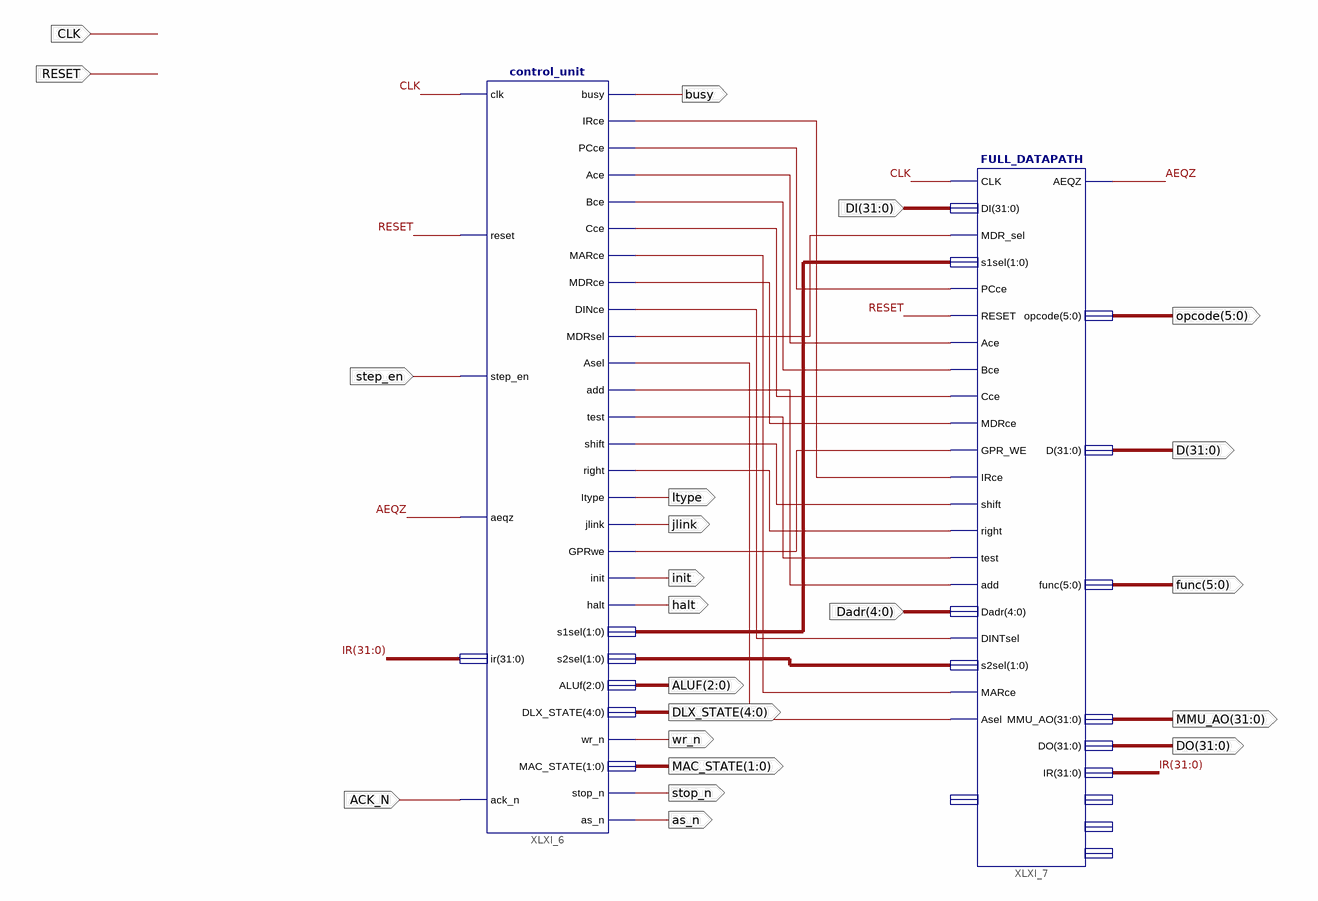
[diagram p0: schematic sheet 1]
// Xilinx ISE schematic DLX.sch (spartan6) as structural Verilog: 2 symbols, 22 ports
module DLX (
  input  CLK,
  input  RESET,
  input  [31:0] DI,
  input  [4:0] Dadr,
  input  step_en,
  input  ACK_N,
  output [5:0] func,
  output [31:0] MMU_AO,
  output [31:0] D,
  output [5:0] opcode,
  output busy,
  output Itype,
  output jlink,
  output init,
  output halt,
  output [2:0] ALUF,
  output [4:0] DLX_STATE,
  output wr_n,
  output [1:0] MAC_STATE,
  output stop_n,
  output as_n,
  output [31:0] DO
);

  wire AEQZ, XLXN_15, XLXN_16, XLXN_17, XLXN_18, XLXN_19, XLXN_20, XLXN_21, XLXN_22, XLXN_27, XLXN_28,
       XLXN_29, XLXN_30, XLXN_31, XLXN_32, XLXN_38;
  wire [1:0] XLXN_39, XLXN_40;
  wire [31:0] IR;

  control_unit XLXI_6 (
    .clk(CLK), .reset(RESET), .step_en(step_en), .aeqz(AEQZ), .ir(IR), .ack_n(ACK_N), .busy(busy),
    .IRce(XLXN_32), .PCce(XLXN_22), .Ace(XLXN_19), .Bce(XLXN_20), .Cce(XLXN_21), .MARce(XLXN_29),
    .MDRce(XLXN_27), .DINce(XLXN_30), .MDRsel(XLXN_28), .Asel(XLXN_31), .add(XLXN_15), .test(XLXN_16),
    .shift(XLXN_17), .right(XLXN_18), .Itype(Itype), .jlink(jlink), .GPRwe(XLXN_38), .init(init),
    .halt(halt), .s1sel(XLXN_39), .s2sel(XLXN_40), .ALUf(ALUF), .DLX_STATE(DLX_STATE), .wr_n(wr_n),
    .MAC_STATE(MAC_STATE), .stop_n(stop_n), .as_n(as_n));
  FULL_DATAPATH XLXI_7 (
    .CLK(CLK), .DI(DI), .MDR_sel(XLXN_28), .s1sel(XLXN_39), .PCce(XLXN_22), .RESET(RESET), .Ace(XLXN_19),
    .Bce(XLXN_20), .MDRce(XLXN_27), .GPR_WE(XLXN_38), .IRce(XLXN_32), .shift(XLXN_17), .right(XLXN_18),
    .test(XLXN_16), .add(XLXN_15), .Dadr(Dadr), .DINTsel(XLXN_30), .s2sel(XLXN_40), .MARce(XLXN_29),
    .Asel(XLXN_31), .Cce(XLXN_21), .AEQZ(AEQZ), .opcode(opcode), .D(D), .func(func), .MMU_AO(MMU_AO),
    .DO(DO), .IR(IR));  // open: REG_C_IN, DINT, A_OUT, B_OUT
endmodule
